# Altium schematic sheet RS485_RS232_Sheet.SchDoc
size 420 x 297 mm; SheetNumber: 5; SheetTotal: 8
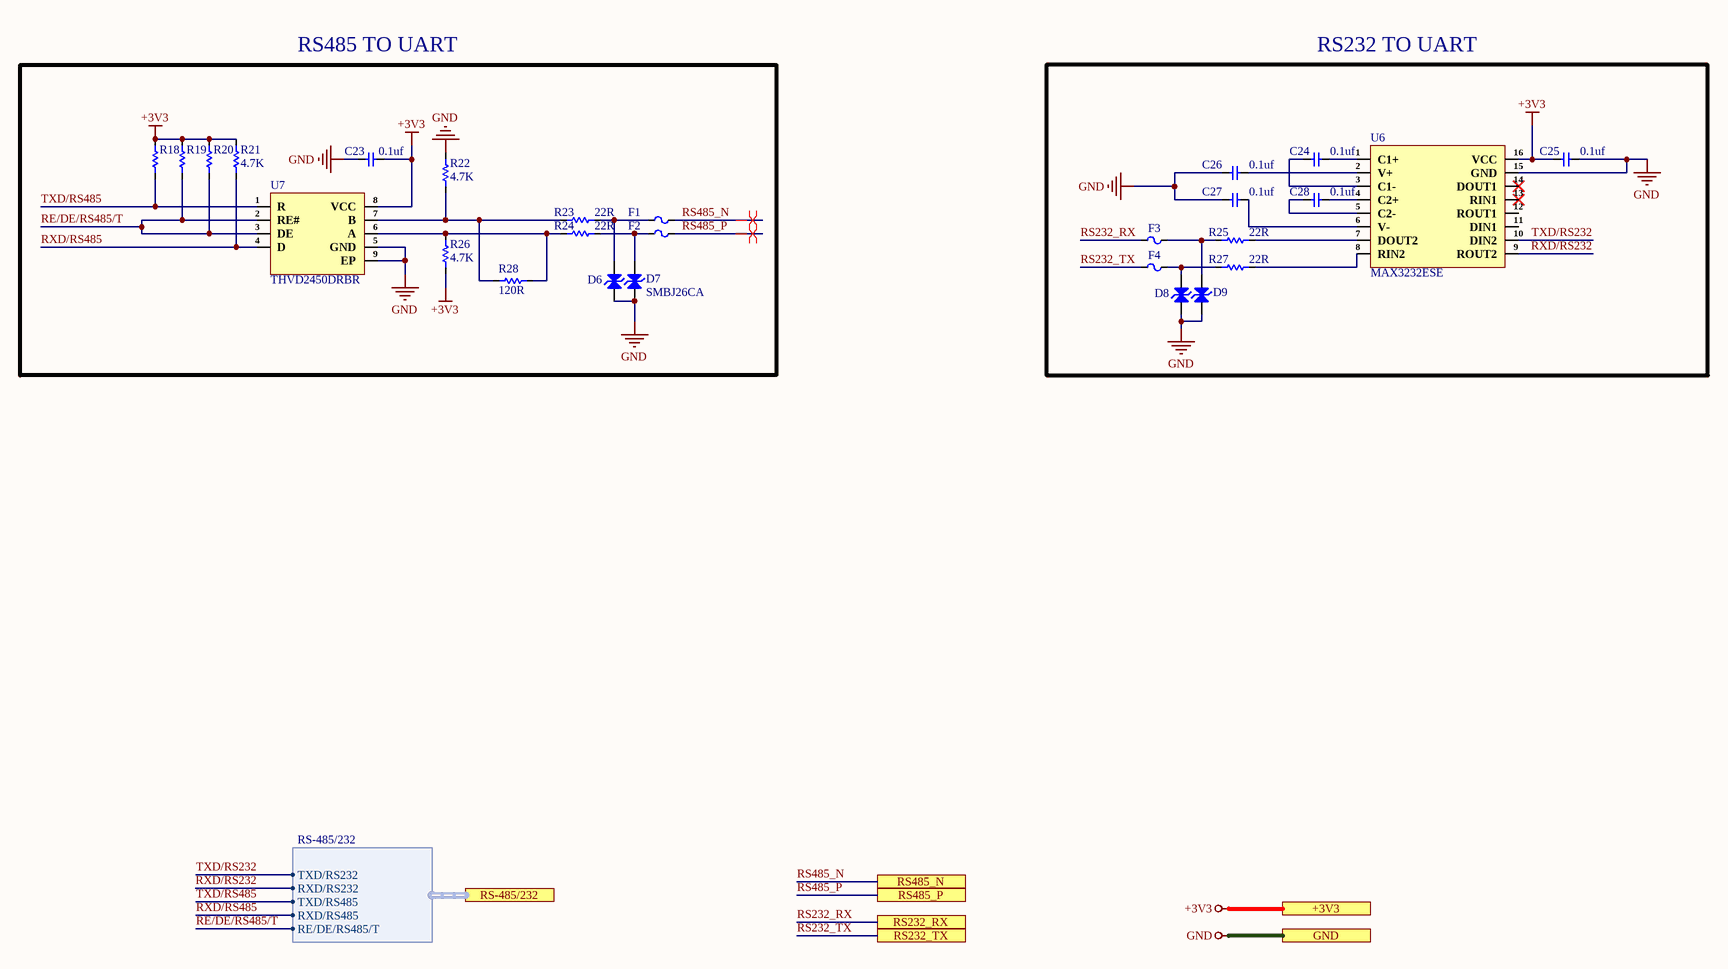
[diagram p0: RS485_RS232_Sheet.SchDoc]

## Parts
C23  0.1uf  [Cap-0402]
C24  0.1uf  [Cap-0402]
C25  0.1uf  [Cap-0402]
C26  0.1uf  [Cap-0402]
C27  0.1uf  [Cap-0402]
C28  0.1uf  [Cap-0402]
D6  SMBJ26CA  [SMB Bi Directional]  (value not drawn)
D7  SMBJ26CA  [SMB Bi Directional]
D8  SMBJ26CA  [SMB Bi Directional]  (value not drawn)
D9  SMBJ26CA  [SMB Bi Directional]  (value not drawn)
F1  SMD0805P020TF  [Fuse-0805]  (value not drawn)
F2  SMD0805P020TF  [Fuse-0805]  (value not drawn)
F3  SMD0805P020TF  [Fuse-0805]  (value not drawn)
F4  SMD0805P020TF  [Fuse-0805]  (value not drawn)
R18  4.7K  [Res-0402]  (value not drawn)
R19  4.7K  [Res-0402]  (value not drawn)
R20  4.7K  [Res-0402]  (value not drawn)
R21  4.7K  [Res-0402]
R22  4.7K  [Res-0402]
R23  22R  [Res-0201]
R24  22R  [Res-0201]
R25  22R  [Res-0201]
R26  4.7K  [Res-0402]
R27  22R  [Res-0201]
R28  120R  [Res-0603]
U6  MAX3232ESE  [SOP-16]
U7  THVD2450DRBR  [SON-8-EP(3x3)]

## Ports
+3V3 (see Top_Sheet[4B], CAN_Sheet[5D], Connector_Sheet1[5D], Connector_Sheet2[3D], Controller_Sheet[2D], Motor_Driver_Sheet[5D], Power_Sheet[5D]), GND (see Top_Sheet[4B], CAN_Sheet[5D], Connector_Sheet1[5D], Connector_Sheet2[3D], Controller_Sheet[2D], Motor_Driver_Sheet[5D], Power_Sheet[5D]), RS232_RX (see Top_Sheet[4B], Connector_Sheet1[4D]), RS232_TX (see Top_Sheet[4B], Connector_Sheet1[4D]), RS485_N (see Top_Sheet[4B], Connector_Sheet1[3D]), RS485_P (see Top_Sheet[4B], Connector_Sheet1[3D]), RS-485/232 (harness RS-485/232, see Top_Sheet[4B], Controller_Sheet[4D])

## Harnesses
RS-485/232: TXD/RS232, RXD/RS232, TXD/RS485, RXD/RS485, RE/DE/RS485/T

## Nets
+3V3: C23.2 C25.2 R18.2 R19.2 R20.2 R21.2 R26.1 U6.16(VCC) U7.8(VCC) ; port +3V3
GND: C23.1 C25.1 C26.1 C27.1 D6.1(A) D7.1(A) D8.1(A) D9.1(A) R22.2 U6.15(GND) U7.5(GND) U7.9(EP) ; port GND
RE/DE/RS485/T: R19.1 R20.1 U7.2(RE#) U7.3(DE) ; port RS-485/232.RE/DE/RS485/T
RS232_RX: F3.1 ; port RS232_RX
RS232_TX: F4.1 ; port RS232_TX
RS485_N: F1.2 ; port RS485_N
RS485_P: F2.2 ; port RS485_P
RXD/RS232: U6.9(ROUT2) ; port RS-485/232.RXD/RS232
RXD/RS485: R21.1 U7.4(D) ; port RS-485/232.RXD/RS485
TXD/RS232: U6.10(DIN2) ; port RS-485/232.TXD/RS232
TXD/RS485: R18.1 U7.1(R) ; port RS-485/232.TXD/RS485
NetC24_1: C24.1 U6.1(C1+)
NetC24_2: C24.2 U6.3(C1-)
NetC26_2: C26.2 U6.2(V+)
NetC27_2: C27.2 U6.6(V-)
NetC28_1: C28.1 U6.4(C2+)
NetC28_2: C28.2 U6.5(C2-)
NetD6_2: D6.2(K) F1.1 R23.2
NetD7_2: D7.2(K) F2.1 R24.2
NetD8_2: D8.2(K) F4.2 R27.1
NetD9_2: D9.2(K) F3.2 R25.1
NetR22_1: R22.1 R23.1 R28.1 U7.7(B)
NetR24_1: R24.1 R26.2 R28.2 U7.6(A)
NetR25_2: R25.2 U6.7(DOUT2)
NetR27_2: R27.2 U6.8(RIN2)

Not connected (* = marked no-connect by the designer): U6 11(DIN1) 12(ROUT1) 13(RIN1)* 14(DOUT1)*

## Layout directives
differential pair; net class RS485; differential pair class RS485_LINES; rule Impedance Constraint [Min = 115.0    Max = 125.0    ]; rule Matched Net Lengths [Tolerance = 0.508mm]: RS485_N, RS485_P

## Notes on the sheet
- RS485 TO UART
- RS232 TO UART
- File:
- Title:
- Date:
- Page
- Num:
- Total:
- Drawn By: Huzaifa Ali

## Library data of the parts
C23-C28 = GRM155R62A104KE14D: CAP CER 0.1UF 100V X5R 0402; Manufacturer: Murata; Capacitance: 100nF; Tolerance: 10%; Item Type: Capacitor; Supplier 1: Arrow Electronics; Manufacturer Part Number: GRM155R62A104KE14D; RoHS: Yes; Category: Ceramic Capacitors; Stock 1: 870000; Pricing 1: 10000=0.00500, 20000=0.00410, 30000=0.00390, 50000=0.00370, 100000=0.00300 (USD); Mount: Surface Mount; Case/Package: 0402; Case Code (Metric): 1005; Case Code (Imperial): 0402; Weight: 0.000212oz; Min Operating Temperature: -55°C; Max Operating Temperature: 85°C; Packaging: Tape and Reel; Voltage Rating: 100V; Dielectric: X5R; Termination: SMD/SMT; Voltage Rating (DC): 100V; Package Quantity: 10000; Series: GRM; Length: 0.039inch; Width: 0.02inch; Height: 0.5mm; Thickness: 0.022inch; Reach SVHC Compliant: Yes; Lead Free: Lead Free; RoHS Compliant: Yes; ComponentLink1URL: http://www.farnell.com/datasheets/2079151.pdf?src-supplier=Farnell; ComponentLink1Description: http://www.farnell.com/datasheets/2079151.pdf?src-supplier=Farnell; ComponentLink2URL: http://www.mouser.com/ds/2/281/c02e-2905.pdf?src-supplier=Mouser; ComponentLink2Description: http://www.mouser.com/ds/2/281/c02e-2905.pdf?src-supplier=Mouser; ComponentLink3URL: http://www.farnell.com/datasheets/2079151.pdf?src-supplier=Element14; ComponentLink3Description: http://www.farnell.com/datasheets/2079151.pdf?src-supplier=Element14; ComponentLink4URL: http://search.murata.co.jp/Ceramy/image/img/A01X/G101/ENG/GRM155R62A104KE14-01.pdf?src-supplier=Digi-Key; ComponentLink4Description: http://search.murata.co.jp/Ceramy/image/img/A01X/G101/ENG/GRM155R62A104KE14-01.pdf?src-supplier=Digi-Key; ComponentLink5URL: http://www.farnell.com/datasheets/2079151.pdf?src-supplier=Newark; ComponentLink5Description: http://www.farnell.com/datasheets/2079151.pdf?src-supplier=Newark; Supplier Part Number 1: GRM155R62A104KE14D; LCSC Part Number: C162178
D6-D9 = SMBJ26CA: SMB(DO-214AA) TVS ROHS; Manufacturer: MSKSEMI; Item Type: Diode; Manufacturer Part Number: SMBJ26CA; Package: SMB(DO-214AA); LCSC Part Number: C5331111; ComponentLink1Description: LCSC; ComponentLink1URL: https://www.lcsc.com/product-detail/TVS_MSKSEMI-SMBJ26CA_C5331111.html
F1-F4 = SMD0805P020TF: 9V 200mA 100A 500mA 0805 Resettable Fuses ROHS; Manufacturer: RUILON; Item Type: Fuse; Manufacturer Part Number: SMD0805P020TF; Package: 0805; LCSC Part Number: C20976; ComponentLink1Description: LCSC; ComponentLink1URL: https://www.lcsc.com/product-detail/Resettable-Fuses_RUILON-Shenzhen-Ruilongyuan-Elec-SMD0805P020TF_C20976.html
R18-R22 R26 = RC0402FR-074K7L: RES 4.7K OHM 1% 1/16W 0402; Manufacturer: Yageo; Voltage Rating (DC): 50V; Power Rating: 62.5mW; Resistance: 4.7kR; Temperature Coefficient: 100ppm/°C; Max Power Dissipation: 63mW; Item Type: Resistor; Supplier 1: Avnet; Manufacturer Part Number: RC0402FR-074K7L; RoHS: Yes; Category: Chip SMD Resistors; Stock 1: 2420000; Pricing 1: 10000=0.00085 (USD); Case/Package: 0402; Number of Pins: 2; Case Code (Imperial): 0402; Case Code (Metric): 1005; Size Code: 0402; Min Operating Temperature: -55°C; Max Operating Temperature: 155°C; Tolerance: 1%; Voltage Rating: 50V; Packaging: Tape and Reel; Resistor Type: Thick Film; Termination: SMD/SMT; Features: Moisture Resistant; Series: RC; Number of Terminations: 2; Resistance Tolerance: 1%; Construction: Rectangular; Length: 1mm; Width: 0.5mm; Height: 0.32mm; Depth: 0.5mm; Height - Seated (Max): 0.016inch; RoHS Compliant: Yes; Reach SVHC Compliant: Yes; Military Standard: Not; Lead Free: Lead Free; ComponentLink1URL: https://datasheet.ciiva.com/22661/1686128-22661342.pdf?src-supplier=Element14; ComponentLink1Description: https://datasheet.ciiva.com/22661/1686128-22661342.pdf?src-supplier=Element14; ComponentLink2URL: https://datasheet.ciiva.com/7850/1018594-7850022.pdf?src-supplier=Element14; ComponentLink2Description: https://datasheet.ciiva.com/7850/1018594-7850022.pdf?src-supplier=Element14; ComponentLink3URL: https://datasheet.ciiva.com/7850/1018594-7850023.pdf?src-supplier=Element14; ComponentLink3Description: https://datasheet.ciiva.com/7850/1018594-7850023.pdf?src-supplier=Element14; ComponentLink4URL: https://datasheet.ciiva.com/15215/getdatasheetpartid-328119-15215035.pdf?src-supplier=Verical; ComponentLink4Description: https://datasheet.ciiva.com/15215/getdatasheetpartid-328119-15215035.pdf?src-supplier=Verical; Supplier Part Number 1: RC0402FR-074K7L; LCSC Part Number: C105871
R23-R25 R27 = RC0201FR-0722RL: RES 22 OHM 1% 1/20W 0201; Manufacturer: Yageo; Item Type: Resistor; Supplier: Future Electronics; Supplier Part Number: 5973409; Manufacturer Part Number: RC0201FR-0722RL; RoHS: Yes; Category: Chip SMD Resistors; Stock: 17980000; Pricing: 10000=0.0014, 50000=0.0013, 250000=0.0013, 750000=0.0012, 2000000=0.0011 (USD); ComponentLink1URL: https://datasheet.ciiva.com/7672/1563626-7672215.pdf?src-supplier=Element14; ComponentLink1Description: https://datasheet.ciiva.com/7672/1563626-7672215.pdf?src-supplier=Element14; LCSC Part Number: C155743
R28 = RC0603JR-07120RL: RES 120 OHM 5% 1/10W 0603; Manufacturer: Yageo; Voltage Rating (AC): 50V; Item Type: Resistor; Supplier: Future Electronics; Supplier Part Number: 4045720; Manufacturer Part Number: RC0603JR-07120RL; RoHS: Yes; Category: Chip SMD Resistors; Stock: 570000; Pricing: 5000=0.0015, 75000=0.0015, 250000=0.0014, 750000=0.0013, 2500000=0.0012 (USD); ComponentLink1URL: https://datasheet.ciiva.com/15189/getdatasheetpartid-326532-15189850.pdf?src-supplier=Verical; ComponentLink1Description: https://datasheet.ciiva.com/15189/getdatasheetpartid-326532-15189850.pdf?src-supplier=Verical; ComponentLink2URL: https://datasheet.ciiva.com/2518/pyu-r-int-thick-7-2518850.pdf?src-supplier=Digi-Key; ComponentLink2Description: https://datasheet.ciiva.com/2518/pyu-r-int-thick-7-2518850.pdf?src-supplier=Digi-Key; ComponentLink3URL: https://datasheet.ciiva.com/2518/pyu-r-int-thick-7-2518851.pdf?src-supplier=Digi-Key; ComponentLink3Description: https://datasheet.ciiva.com/2518/pyu-r-int-thick-7-2518851.pdf?src-supplier=Digi-Key; ComponentLink4URL: https://datasheet.ciiva.com/2518/pyu-r-int-thick-7-2518852.pdf?src-supplier=Digi-Key; ComponentLink4Description: https://datasheet.ciiva.com/2518/pyu-r-int-thick-7-2518852.pdf?src-supplier=Digi-Key; ComponentLink5URL: https://datasheet.ciiva.com/46395/443971-46395070.pdf?src-supplier=Element14; ComponentLink5Description: https://datasheet.ciiva.com/46395/443971-46395070.pdf?src-supplier=Element14; ComponentLink6URL: https://datasheet.ciiva.com/12555/rc0603-272842-12555246.pdf?src-supplier=Mouser; ComponentLink6Description: https://datasheet.ciiva.com/12555/rc0603-272842-12555246.pdf?src-supplier=Mouser; LCSC Part Number: C114681
U6 = MAX3232ESE: 250Kbps transceiver 2/2 SOP-16 RS232 ICs ROHS; Manufacturer: UMW; Item Type: IC; Manufacturer Part Number: MAX3232ESE; Package: SOP-16; LCSC Part Number: C2904738; ComponentLink1Description: LCSC; ComponentLink1URL: https://www.lcsc.com/product-detail/RS232-ICs_UMW-Youtai-Semiconductor-Co-Ltd-MAX3232ESE_C2904738.html
U7 = THVD2450DRBR: IC TRANSCEIVER HALF 1/1 8SON; Manufacturer: Texas Instruments; Supplier: Digikey; Supplier Part Number: 296-THVD2450DRBRCT-ND; Manufacturer Part Number: THVD2450DRBR; RoHS: Yes; Item Type: IC; Stock: 2652; Pricing: 1=4.05, 10=3.639, 25=3.4404, 100=2.9818, 250=2.82892, 500=2.53838, 1000=2.1408 (USD); Pins: 8NUMBER; Length: 3mm; Width: 3mm; Height: 1mm; Thickness: 880um; LCSC Part Number: C2878080